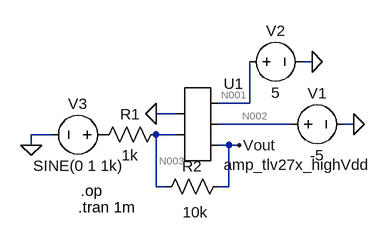
[diagram p0: schematic Lab5.asc]
* Lab5.asc
* U1: amp_tlv27x_highVdd (symbol AutoGenerated\amp_tlv27x_highVdd not available, pins judged from their places): pin1=0 pin2=N003 pin3=N001 pin4=N002 pin5=Vout
V1 N002 0 -5
V2 N001 0 5
R2 Vout N003 10k
R1 N003 P001 1k
V3 P001 0 SINE(0 1 1k)
.op
.tran 1m
.backanno
.end

* Results of the author's LTspice run, read from the files saved beside the schematic
* Operating Point, zero values left out:
*   V(vout) = -3.084 mV
*   V(n002) = -5 V
*   V(n001) = 5 V
*   V(n003) = -280.4 µV
*   I(R1) = -280.4 nA
*   I(R2) = -280.4 nA
*   I(V3) = -280.4 nA
*   I(V2) = -67.78 µA
*   I(V1) = 67.78 µA
*   Ix(u1:1) = -6.9 pA
*   Ix(u1:2) = -6.901 pA
*   Ix(u1:3) = 67.78 µA
*   Ix(u1:4) = -67.78 µA
*   Ix(u1:5) = 280.4 nA
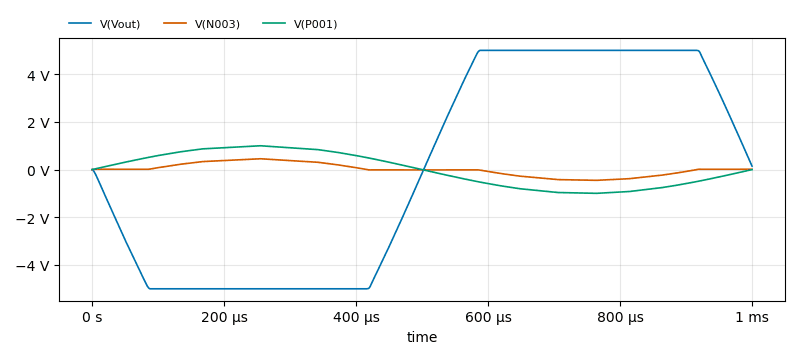
[diagram p1: Transient Analysis of Lab5.asc, plotted from the saved traces]
* Transient Analysis, 1 run:
*   V(Vout): min -5 V, max 5 V, average -1.199 mV, rms 4.429 V, last 147.7 mV
*   V(N003): min -450.7 mV, max 453.6 mV, average -2.342 mV, rms 261.5 mV, last 13.43 mV
*   V(P001): min -995.8 mV, max 998.9 mV, average -2.457 mV, rms 700.1 mV, last 0 V